# EAGLE design Buck Driver V2 (EAGLE 7.1.0)
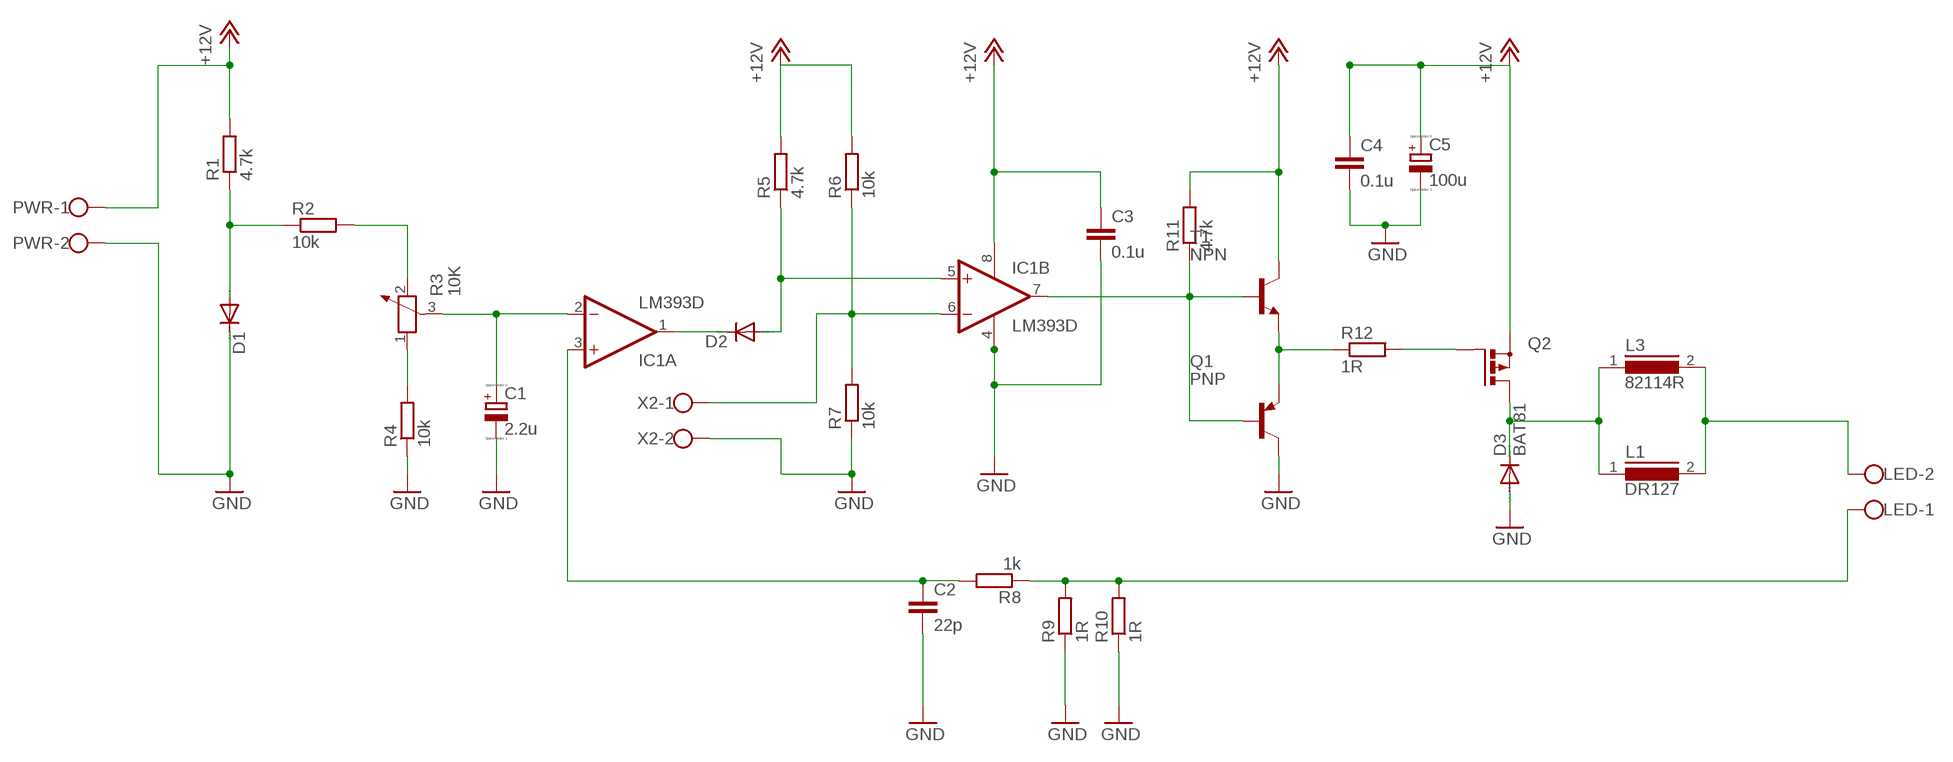
[diagram p0: schematic, sheet 1]

## Parts
C1  2.2u  CPOL-EU140CLH-0810  [140CLH-0810]
C2  22p  C-EUC1206  [C1206]
C3  0.1u  C-EUC1206  [C1206]
C4  0.1u  C-EUC1206  [C1206]
C5  100u  CPOL-EU140CLH-0810  [140CLH-0810]
D1  DIODE-DO214BA  [DO214BA]
D2  DIODE-DO214BA  [DO214BA]
D3  BAT81  [DO34-7]
IC1  LM393D  [SO08]
L1  DR127  [DR127]
L3  82114R  [82114R]
LED  W237-102  [W237-102]
PWR  W237-102  [W237-102]
Q1  PNP  BC856ALT1SMD  [SOT23-BEC]
Q2  PMOSFET_PTO220BH  [TO220BH]
R1  4.7k  R-EU_R1206  [R1206]
R2  10k  R-EU_R1206  [R1206]
R3  10K  POTENTIOMETER_PT_SPIN  [PT-SPIN]
R4  10k  R-EU_R1206  [R1206]
R5  4.7k  R-EU_R1206  [R1206]
R6  10k  R-EU_R1206  [R1206]
R7  10k  R-EU_R1206  [R1206]
R8  1k  R-EU_R1206  [R1206]
R9  1R  R-EU_R2512  [R2512]
R10  1R  R-EU_R2512  [R2512]
R11  4.7k  R-EU_R1206  [R1206]
R12  1R  R-EU_R1206  [R1206]
T1  NPN  BC847  [SOT23]
X2  W237-102  [W237-102]

## Nets
+12V: C3.1 C4.1 C5.+ IC1.8(P:V+) PWR.1 Q2.S R1.2 R5.2 R6.2 R11.2 T1.3(C)
GND: C1.- C2.2 C3.2 C4.2 C5.- D1.C D3.A IC1.4(P:V-) PWR.2 Q1.C R4.1 R7.1 R9.1 R10.1 X2.2
N$1: D1.A R1.1 R2.1
N$2: C1.+ IC1.2(A:-IN) R3.3
N$3: R3.1 R4.2
N$4: R2.2 R3.2
N$5: C2.1 IC1.3(A:+IN) R8.2
N$6: D2.C IC1.1(A:OUT)
N$7: D2.A IC1.5(B:+IN) R5.1
N$8: LED.1 R8.1 R9.2 R10.2
N$9: Q1.E R12.1 T1.2(E)
N$10: Q2.G R12.2
N$11: D3.C L1.1 L3.1 Q2.D
N$12: IC1.7(B:OUT) Q1.B R11.1 T1.1(B)
N$13: L1.2 L3.2 LED.2
PWM: IC1.6(B:-IN) R6.1 R7.2 X2.1

## Library data of the parts
C1 C5 = rcl:CPOL-EU: POLARIZED CAPACITOR, European symbol
C2-C4 = rcl:C-EU: CAPACITOR, European symbol; SPICEPREFIX: C
D1 D2 = diode:DIODE-: DIODE
D3 = diode:BAT81: DIODE barrier diode
IC1 = linear:LM393: COMPARATOR
L1 = inductors:DR127: High Power Density, High Efficiency, Shielded Inductors Source: coiltronics_dr_series.pdf
L3 = inductors:82114R: INDUCTOR
LED PWR X2 = con-wago-500:W237-102: WAGO SCREW CLAMP; MPN: 237-102; OC_FARNELL: unknown; OC_NEWARK: 70K9898
Q1 = transistor-pnp:BC856*: PNP Transistror
Q2 = transistor-power:PMOSFET_P: Power MOSFET P-Channel
R1 R2 R4-R12 = rcl:R-EU_: RESISTOR, European symbol
R3 = rcl:POTENTIOMETER_: Potentiometer
T1 = transistor-neu-to92:BC847: NPN TRANSISTOR

## Board
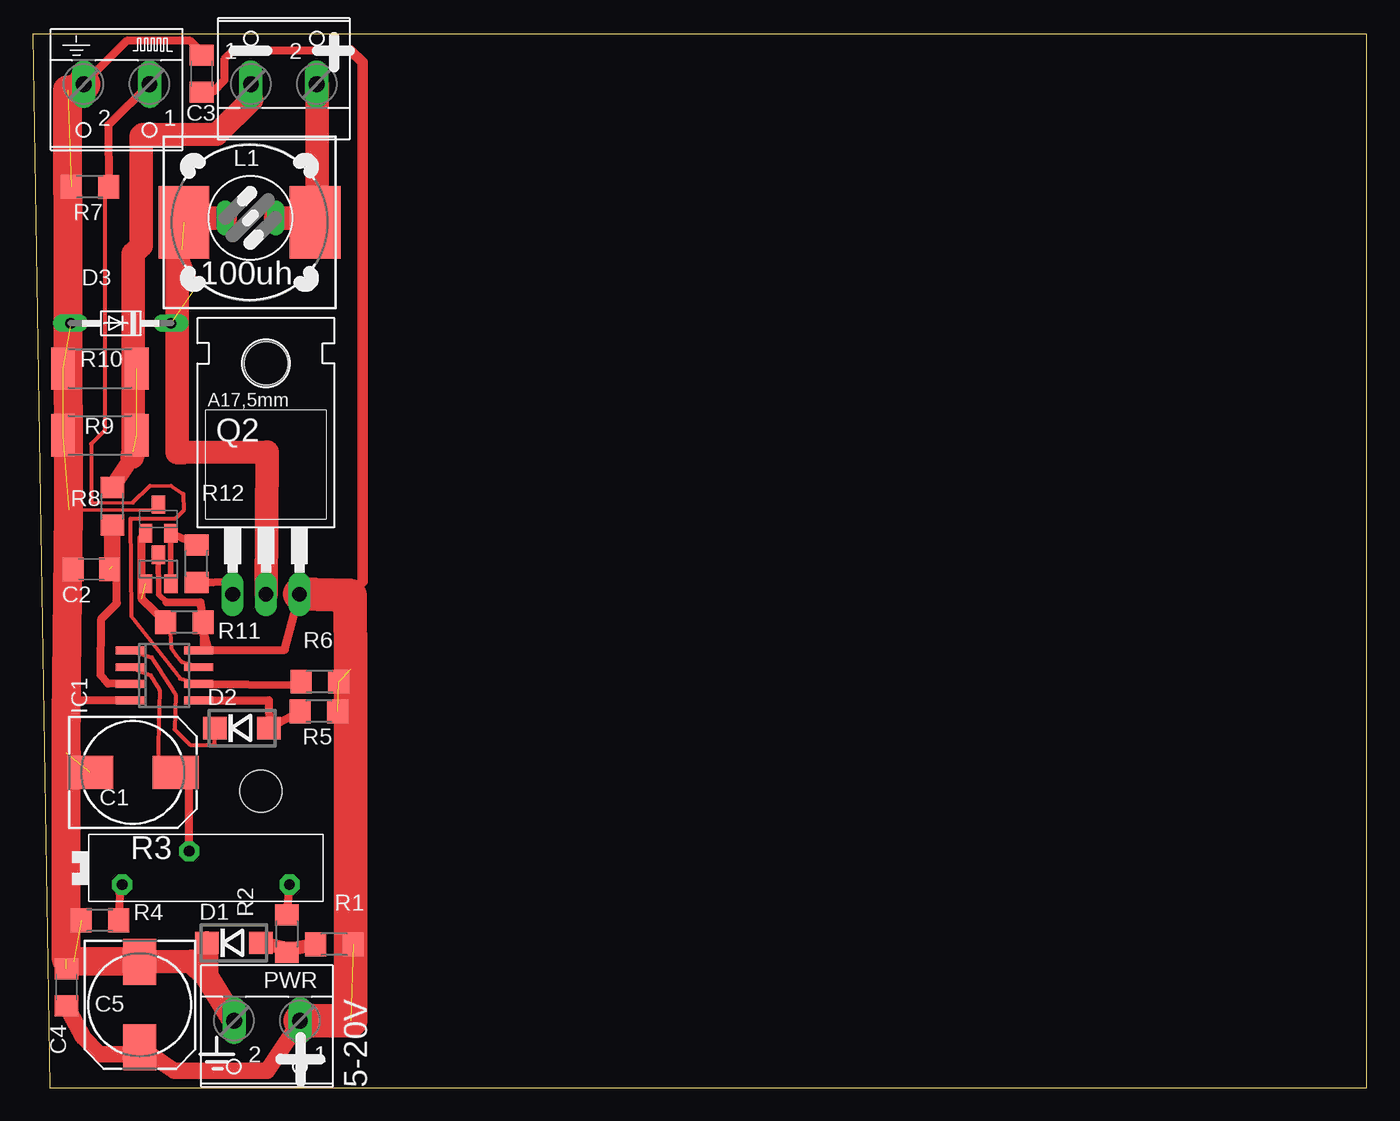
[diagram p1: board, top side]

Size 101.27 x 80 mm. Coordinates in mm from the lower left corner, seen from the top.
Outline: 1.27,0 101.27,0 101.27,80 0,80 1.27,0
Copper layers (1*16): Top 0.035mm / dielectric 1.5mm / Bottom 0.035mm
Design rules "default": minimum track width 10mil, minimum drill 24mil, track to track 8mil, track to pad 8mil, pad to pad 8mil, via to via 8mil, smd to smd 8mil, copper to edge 40mil, drill to drill 8mil, minimum pad ring 10mil, minimum via ring 8mil, stop-mask expansion 4mil, vias tented up to drill 0mil, thermal gap 10mil
Holes 3.2 mm at 17.33,22.5

### Footprints (pad centres in the part's own frame; a part is rotated, then mirrored left to right if it is on the bottom)
140CLH-0810 = smd 3.5 x 2.5: + 3.25,0; - -3.25,0
C1206 = smd 1.6 x 1.8: 1 -1.4,0; 2 1.4,0
DO214BA = smd 1.8 x 1.7: A 2.05,0; C -2.05,0
DO34-7 = drill 0.813 long: A 3.81,0; C -3.81,0
SO08 = smd 0.6 x 2.2: 1 -1.905,-2.6; 2 -0.635,-2.6; 3 0.635,-2.6; 4 1.905,-2.6; 5 1.905,2.6; 6 0.635,2.6; 7 -0.635,2.6; 8 -1.905,2.6
DR127 = smd 3.85 x 5.5: 1 -4.975,0; 2 4.975,0
82114R = drill 0.813 long: 1 0,1.905; 2 0,-1.905
W237-102 = drill 1.194 long: 1 -2.5,-1.27; 2 2.5,-1.27
SOT23-BEC = smd 1 x 1.4: B -0.95,-1.1; C 0,1.1; E 0.95,-1.1
TO220BH = drill 1.118 long: D 0,-6.35; G -2.54,-6.35; S 2.54,-6.35 | hole 3.302: 0,11.176
R1206 = smd 1.6 x 1.803: 1 -1.422,0; 2 1.422,0
PT-SPIN = drill 0.813 pad 1.524 octagon: 1 -6.35,-1.27; 2 6.35,-1.27; 3 -1.27,1.27
R2512 = smd 1.8 x 3.2: 1 -2.8,0; 2 2.8,0
SOT23 = smd 1 x 1.4: 1 -0.95,-1.1; 2 0.95,-1.1; 3 0,1.1

### Placement (x,y rotation side)
C1  7.59,23.93 0 top
C2  4.45,39.37 180 top
C3  12.81,76.99 90 top
C4  2.54,7.62 90 top
C5  8.12,6.3 270 top
D1  15.26,10.99 0 top
D2  15.88,27.3 0 top
D3  6.67,58.04 180 top
IC1  9.98,31.29 270 top
L1  16.45,65.71 0 top
L3  16.51,66.04 90 top
LED  19.05,77.47 0 top
PWR  17.78,3.81 180 top
Q1  9.53,43.18 0 top
Q2  17.7,43.82 0 top
R1  22.88,10.88 0 top
R2  19.28,11.69 90 top
R3  13.13,16.68 0 top
R4  5.08,12.7 0 top
R5  21.72,28.57 0 top
R6  21.78,30.82 0 top
R7  4.33,68.41 0 top
R8  6.03,44.13 270 top
R9  5.08,49.53 0 top
R10  5.08,54.61 0 top
R11  11.49,35.35 0 top
R12  12.43,39.79 270 top
T1  9.53,39.37 0 top
X2  6.35,74.93 180 top

### Tracks (layer width: path | path; a pad name or v marks a point on that pad's centre or on a via)
+12V  (3 unrouted)
  Top 0.305: IC1.8 13.45,33.4 R11.2
  Top 0.406: T1.3 9.54,37.43 10.14,36.87
  Top 0.61: 10.14,36.87 12.71,36.84 R11.2 12.98,33.2 11.75,33.22 19.13,33.25 Q2.S | 24.13,78.74 15.19,78.74 14.54,78.09 14.54,76.51 13.63,75.6 12.82,75.6 C3.1
  Top 0.813: 24.09,37.39 24.09,37.52 25.02,38.45 25.02,77.85 24.13,78.74
  Top 1.016: 23.5,32.38 24.13,31.75
  Top 1.27: PWR.1 20.28,5.04 17.78,1.27 10.72,1.27 C5.+ 7.62,2.54 5.08,2.54 3.81,3.81 C4.1
  Top 2.54: PWR.1 24.13,5.08 24.13,31.75 24.09,37.39 Q2.S
GND  (7 unrouted)
  Top 0.254: 9.33,43.88 2.71,43.85
  Top 0.305: 9.53,44.45 9.21,44.45 9.33,43.88
  Top 0.61: IC1.4 2.63,29.38 | C2.2 3.06,27.02 2.54,25.4 | Q1.C 9.53,44.45 | C3.2 12.81,78.61 11.94,79.48 7.13,79.48 3.46,75.81
  Top 1.016: 2.63,29.38 2.54,27.94
  Top 1.778: C5.- 12.03,9.6 13.19,8.44 | 13.19,8.44 PWR.2 | D1.C 13.19,8.44
  Top 2.184: 3.46,75.81 2.63,75.76 2.71,43.85 2.54,27.94 2.54,25.4 2.54,9.71 3.1,9.6 C5.-
  Top 2.54: 3.46,75.81 X2.2
N$1
  Top 1.016: D1.A 19.49,10.49 | 19.49,10.49 R2.1 | R1.1 19.49,10.49
N$2
  Top 0.305: IC1.2 8.96,31.3 9.61,30.2 9.53,26.04 9.53,23.57
  Top 0.61: 9.53,23.57 C1.+ 11.86,23.86 R3.3
N$3
  Top 0.61: R3.1 6.59,14.76 R4.2
N$4
  Top 0.61: R2.2 19.55,15.44 R3.2
N$5  (1 unrouted)
  Top 0.61: IC1.3 5.69,30.68 5.13,31.34 5.19,35.6 6.37,36.78 6.35,38.87 C2.1
  Top 1.27: R8.2 6.03,39.56
N$6
  Top 0.305: IC1.1 9.04,32.66 10.82,29.86 10.76,27.2 11.93,26.03 13.82,26.03 D2.C
N$7
  Top 0.61: IC1.5 17.9,29.4 D2.A R5.1
N$8  (2 unrouted)
  Top 0.61: 16.61,75.03 16.55,74.97
  Top 1.27: 7.55,47.87 R8.1
  Top 1.778: LED.1 16.55,74.97 | 7.55,47.87 7.62,48.26 7.62,63.35 8.22,63.94 8.22,72.23 8.33,72.35 13.97,72.39 16.61,75.03
N$9
  Top 0.406: T1.2 Q1.E
  Top 0.61: R12.1 10.49,42.06 Q1.E
N$10
  Top 0.61: R12.2 15.14,38.43 Q2.G
N$11  (2 unrouted)
  Top 0.61: 12.36,60.74 11.32,63.68 | 11.12,47.9 11.43,48.21
  Top 1.778: Q2.D 17.78,48.26 11.43,48.21 10.96,48.21 10.96,63.73 11.32,63.68 | L3.1 12.11,66.04 L1.1
N$12  (1 unrouted)
  Top 0.305: IC1.7 11.34,32.3 10.86,32.84 10.52,33.36 10.46,34.59 R11.1
  Top 0.61: R11.1 8.28,37.1 8.26,41.76 Q1.B
N$13
  Top 1.778: 21.59,66.04 21.59,76.16 LED.2 | L3.2 21.59,66.04 | 21.59,66.04 21.59,65.7 L1.2
PWM
  Top 0.254: 4.44,44.4 7.59,44.41
  Top 0.305: R7.2 6.35,68.58 | IC1.6 11.16,31.06 7.47,35.79 7.4,43.19 10.79,43.18 11.43,43.81 11.42,45.09 10.46,45.71 8.88,45.69 7.59,44.41 | 4.45,45.09 4.44,44.4 4.42,44.42 4.42,48.88 5.07,49.53 5.08,49.53 5.46,49.91 5.46,68.33
  Top 0.406: 6.35,68.58 5.71,68.58 5.46,68.33
  Top 0.61: X2.1 5.72,73.1 R7.2 | IC1.6 20.23,30.58 R6.1

### Text on the board
tNames: 100uh | 5-20V